# EAGLE schematic oak_pcb (EAGLE 7.2.0)
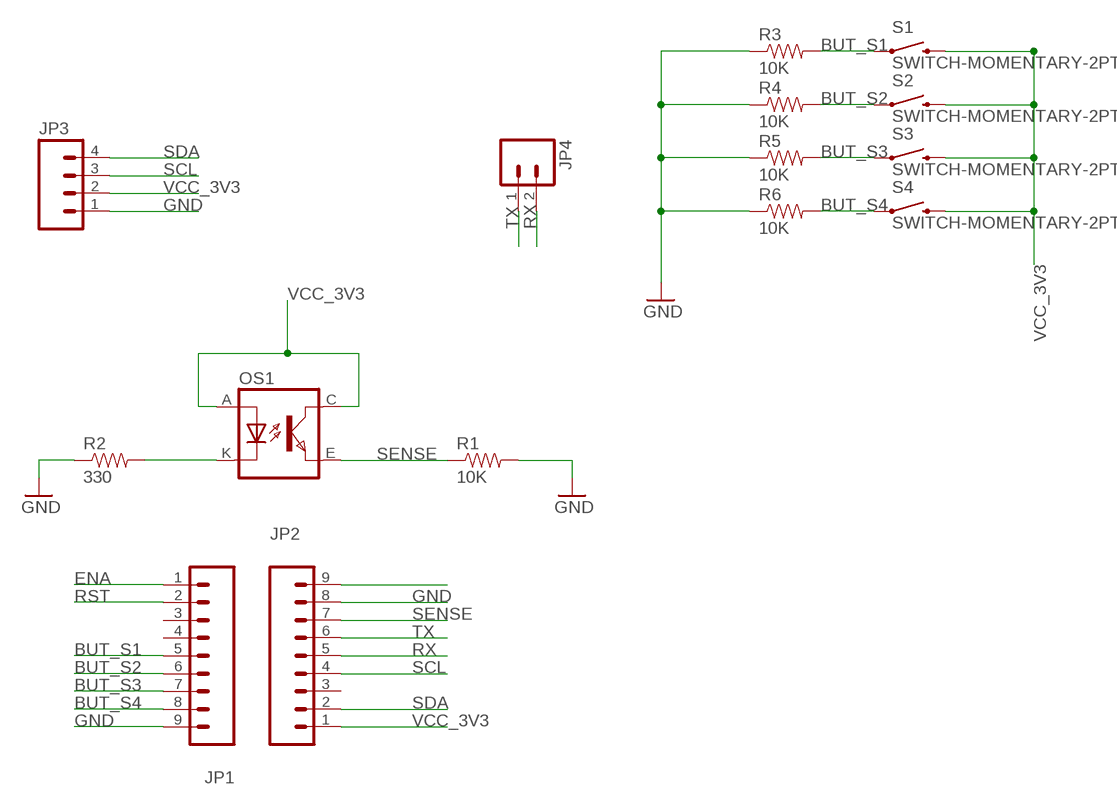
[diagram p0: schematic, sheet 1]

## Parts
JP1  M09LOCK  [1X09_LOCK]
JP2  M09LOCK  [1X09_LOCK]
JP3  M04LOCK  [1X04_LOCK]
JP4  M02LOCK  [1X02_LOCK]
OS1  TCRT5000  [TCRT5000]
R1  10K  RESISTORPTH-1/2W  [AXIAL-0.5]
R2  330  RESISTORPTH-1/2W  [AXIAL-0.5]
R3  10K  RESISTORPTH-1/4W  [AXIAL-0.4]
R4  10K  RESISTORPTH-1/4W  [AXIAL-0.4]
R5  10K  RESISTORPTH-1/4W  [AXIAL-0.4]
R6  10K  RESISTORPTH-1/4W  [AXIAL-0.4]
S1  SWITCH-MOMENTARY-2PTH  [TACTILE-PTH]
S2  SWITCH-MOMENTARY-2PTH  [TACTILE-PTH]
S3  SWITCH-MOMENTARY-2PTH  [TACTILE-PTH]
S4  SWITCH-MOMENTARY-2PTH  [TACTILE-PTH]

## Nets
BUT_S1: JP1.5 R3.P$2 S1.1
BUT_S2: JP1.6 R4.P$2 S2.1
BUT_S3: JP1.7 R5.P$2 S3.1
BUT_S4: JP1.8 R6.P$2 S4.1
ENA: JP1.1
GND: JP1.9 JP2.8 JP3.1 R1.P$2 R2.P$1 R3.P$1 R4.P$1 R5.P$1 R6.P$1
N$1: JP2.9
N$3: OS1.K(CATHODE) R2.P$2
RST: JP1.2
RX: JP2.5 JP4.2
SCL: JP2.4 JP3.3
SDA: JP2.2 JP3.4
SENSE: JP2.7 OS1.E(EMITTER) R1.P$1
TX: JP2.6 JP4.1
VCC_3V3: JP2.1 JP3.2 OS1.A(ANODE) OS1.C(COLLECTOR) S1.3 S2.3 S3.3 S4.3
Unconnected: JP1.3 JP1.4 JP2.3

## Library data of the parts
JP1 JP2 = SparkFun-Connectors:M09: Header 9 Standard 9-pin 0.1" header. Use with straight break away headers (SKU : PRT-00116), right angle break away headers (PRT-00553), swiss pins (PRT-00743), machine pins (PRT-00117), and female headers (PRT-00115).
JP3 = SparkFun-Connectors:M04: Header 4 Standard 4-pin 0.1" header. Use with straight break away headers (SKU : PRT-00116), right angle break away headers (PRT-00553), swiss pins (PRT-00743), machine pins (PRT-00117), and female headers (PRT-00115). Molex polarized connector foot print use with SKU : PRT-08231 with associated crimp pins and housings. 1MM SMD Version SKU: PRT-10208
JP4 = SparkFun-Connectors:M02: Standard 2-pin 0.1" header. Use with - straight break away headers ( PRT-00116) - right angle break away headers (PRT-00553) - swiss pins (PRT-00743) - machine pins (PRT-00117) - female headers (PRT-00115) Molex polarized connector foot print use with: PRT-08233 with associated crimp pins and housings. 2.54_SCREWTERM for use with PRT-10571. 3.5mm Screw Terminal footprints for PRT-08084 5mm Screw Terminal footprints for use with PRT-08432
OS1 = tcrt5000:TCRT5000
R1-R6 = SparkFun-Passives:RESISTOR: Resistor Basic schematic elements and footprints for 0603, 1206, and PTH resistors.
S1-S4 = SparkFun-Electromechanical:SWITCH-MOMENTARY-2: Various NO switches- pushbuttons, reed, etc; PROD_ID: SWCH-08441